# EAGLE design TinyNES_Jumper_Board (EAGLE 9.6.2)
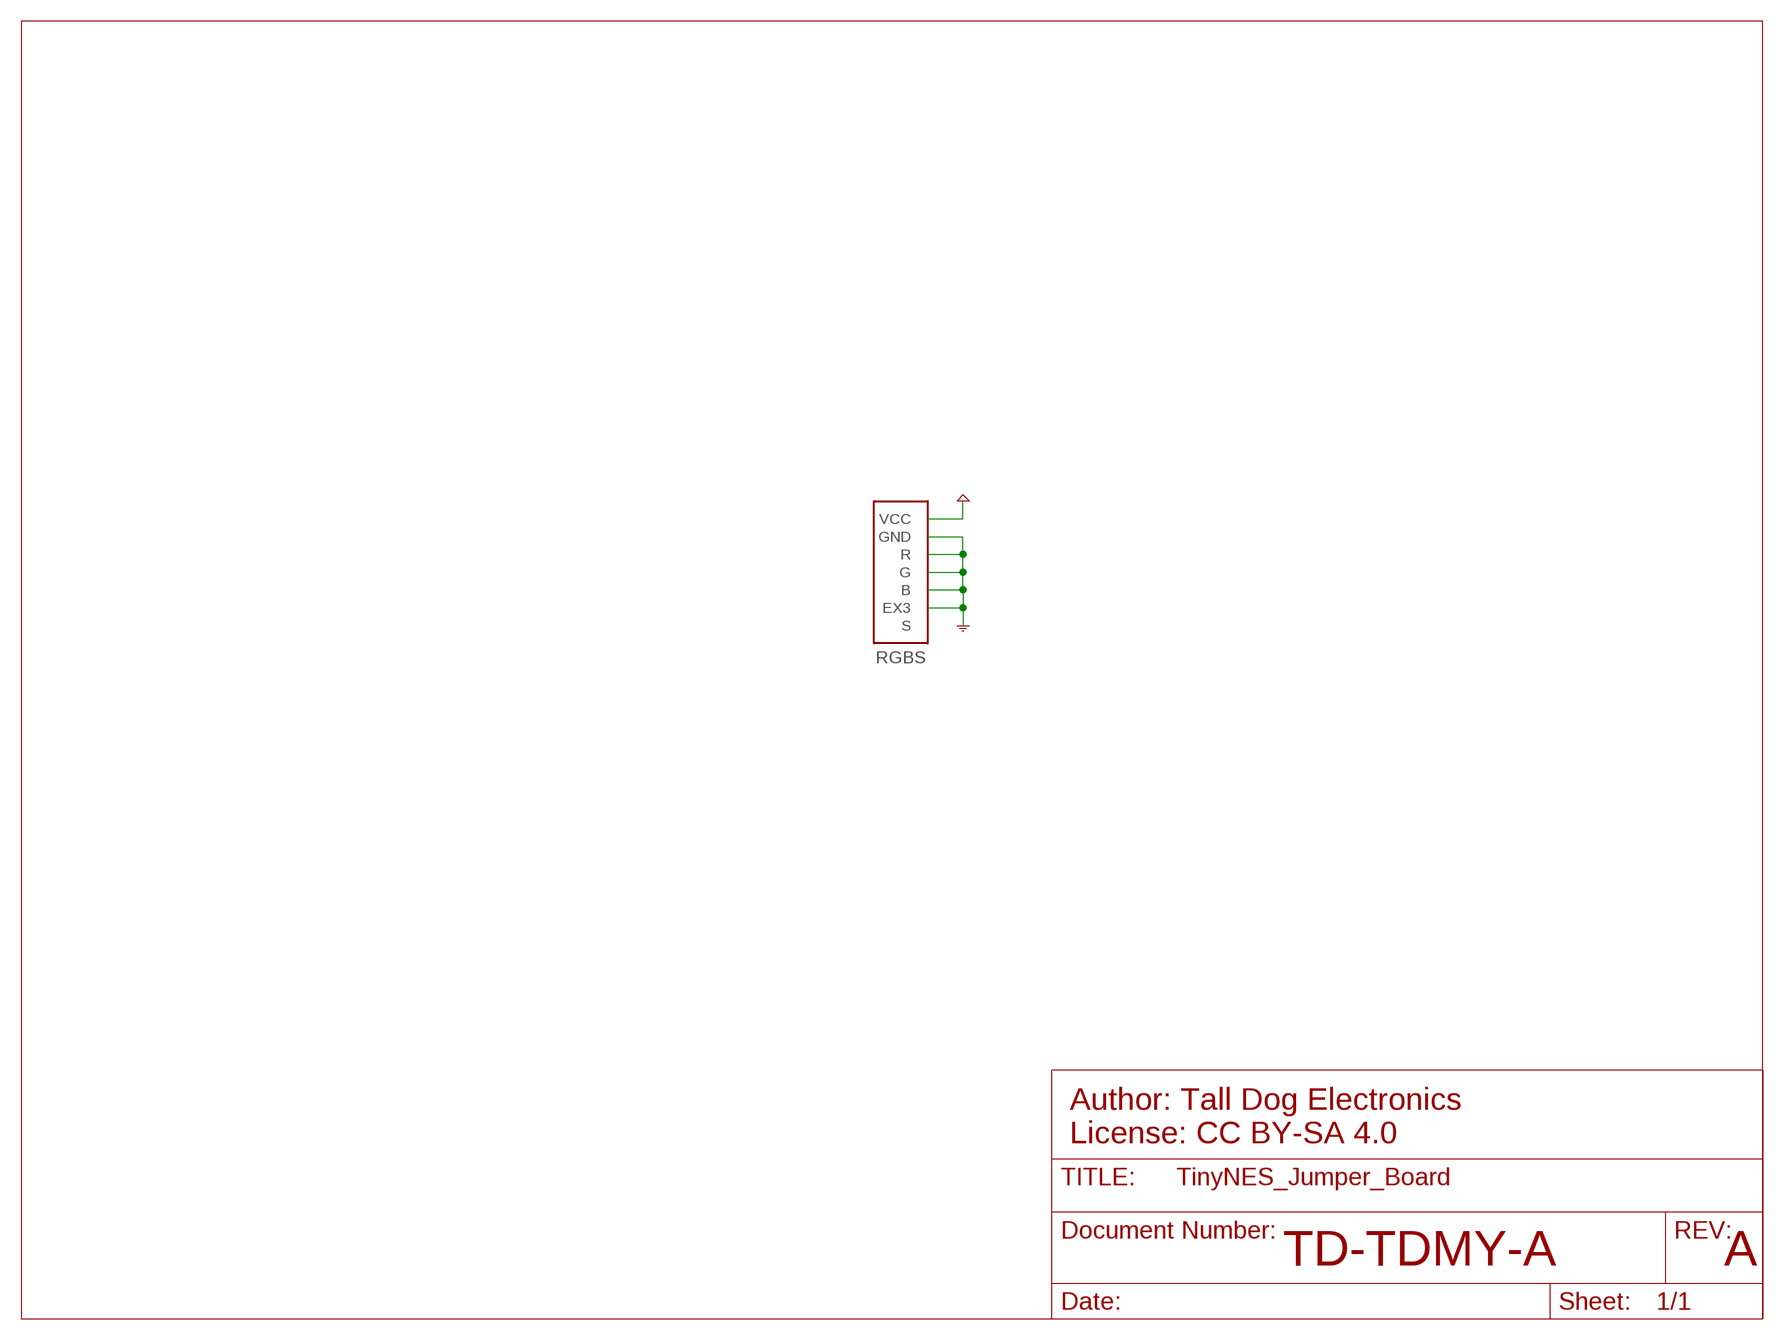
[diagram p0: schematic, sheet 1]

## Parts
RGBS  RGB-BOT  [RGB-BOT]

## Nets
GND: RGBS.B RGBS.EXT3(EX3) RGBS.G RGBS.GND RGBS.R
VCC: RGBS.VCC@1(VCC) RGBS.VCC@2(VCC) RGBS.VCC@3(VCC)
Unconnected: RGBS.S

## Notes on the sheet
- Author: Tall Dog Electronics
  License: CC BY-SA 4.0
- TD-TDMY-A | A

## Library data of the parts
RGBS = TinyNES_Library:RGB

## Board
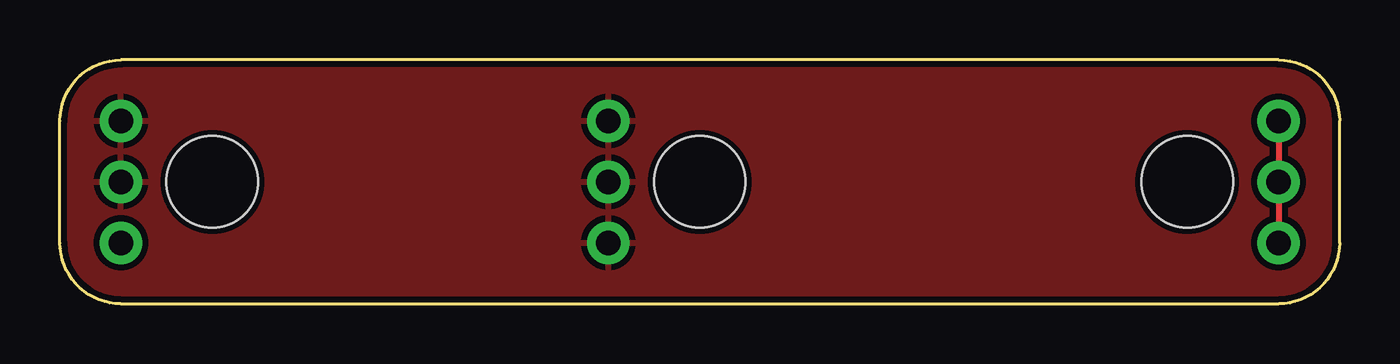
[diagram p1: board, top side]
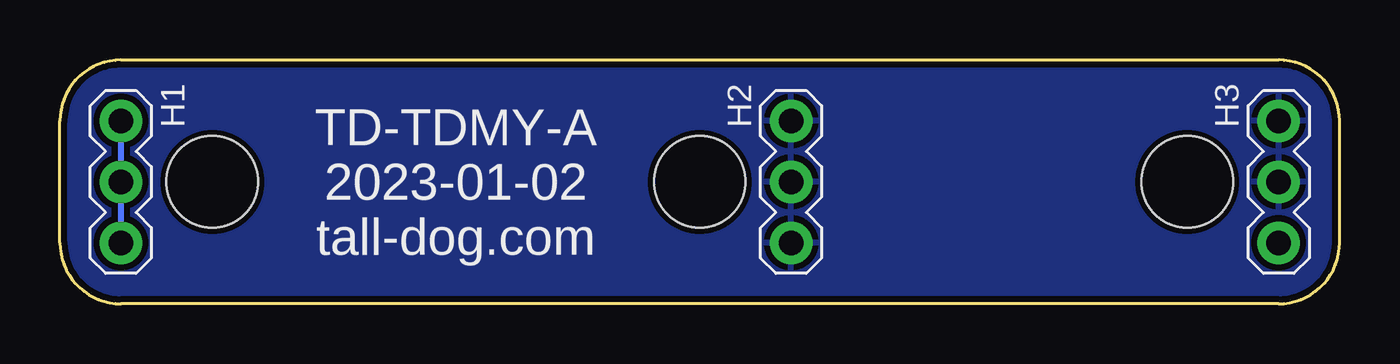
[diagram p2: board, bottom side, seen from below]

Size 53.34 x 10.16 mm. Coordinates in mm from the lower left corner, seen from the top.
Outline: 2.54,0 50.8,0 arc90 53.34,2.54 53.34,7.62 arc90 50.8,10.16 2.54,10.16 arc90 0,7.62 0,2.54 arc90 2.54,0
Copper layers (1*16): Top 0.035mm / dielectric 1.5mm / Bottom 0.035mm
Design rules "default *": minimum track width 8mil, minimum drill 12mil, track to track 8mil, track to pad 8mil, pad to pad 8mil, via to via 8mil, smd to smd 8mil, copper to edge 8mil, drill to drill 8mil, minimum pad ring 8mil, minimum via ring 8mil, stop-mask expansion 0mil, vias tented up to drill 12mil, thermal gap 10mil
Holes 3.81 mm at 6.35,5.08 46.99,5.08 26.67,5.08

### Footprints (pad centres in the part's own frame; a part is rotated, then mirrored left to right if it is on the bottom)
RGB-BOT = drill 1.016 pad 1.778: B -3.81,2.54; EXT3 -24.13,2.54; G -3.81,0; GND -24.13,0; R -3.81,-2.54; S -24.13,-2.54; VCC@1 24.13,2.54; VCC@2 24.13,0; VCC@3 24.13,-2.54

### Placement (x,y rotation side)
RGBS  26.67,5.08 0 top

### Tracks (layer width: path | path; a pad name or v marks a point on that pad's centre or on a via)
GND
  pour Bottom (isolate 0.254): 0,10.16 53.34,10.16 53.34,0 0,0
  pour Top (isolate 0.254): 0,10.16 53.34,10.16 53.34,0 0,0
VCC
  Top 0.254: RGBS.VCC@1 RGBS.VCC@2 RGBS.VCC@3
  Bottom 0.254: RGBS.VCC@1 RGBS.VCC@2 RGBS.VCC@3

### Text on the board
bPlace: H3 | H2 | H1 | TD-TDMY-A / 2023-01-02 / tall-dog.com
bDocu: H3 | H2 | H1